# EAGLE design I2C Expantion sch (EAGLE 9.6.2)
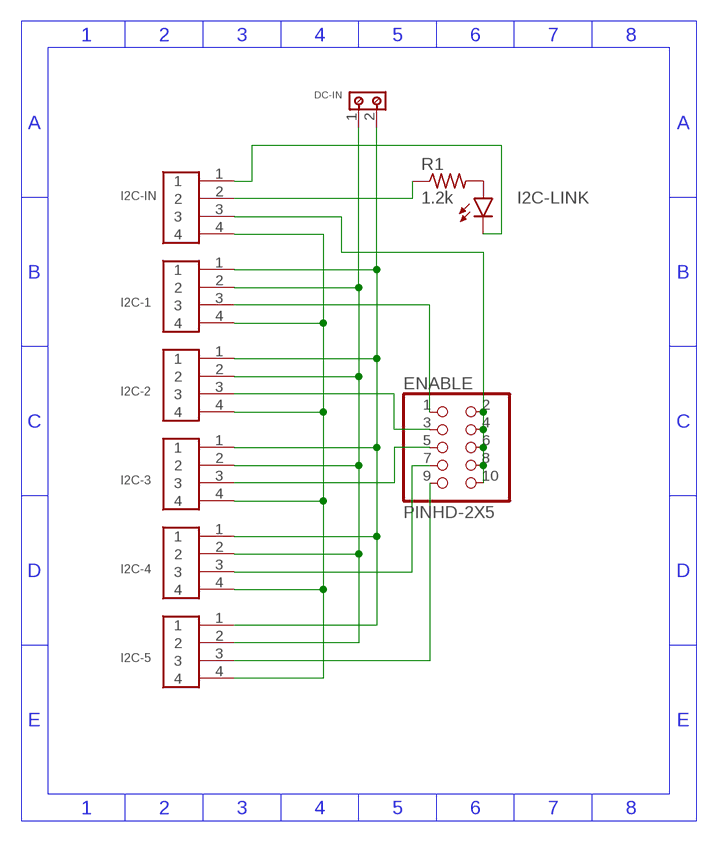
[diagram p0: schematic, sheet 1]

## Parts
DC-IN  691201620002  [691201620002]
ENABLE  PINHD-2X5  [2X05]
I2C-1  B4B-XH-A(LF)(SN)  [B4B-XH-A(LF)(SN)]
I2C-2  B4B-XH-A(LF)(SN)  [B4B-XH-A(LF)(SN)]
I2C-3  B4B-XH-A(LF)(SN)  [B4B-XH-A(LF)(SN)]
I2C-4  B4B-XH-A(LF)(SN)  [B4B-XH-A(LF)(SN)]
I2C-5  B4B-XH-A(LF)(SN)  [B4B-XH-A(LF)(SN)]
I2C-IN  B4B-XH-A(LF)(SN)  [B4B-XH-A(LF)(SN)]
I2C-LINK  LED_BLUE  LED_RADIAL_BLUE  [LEDRD254W60D565H860B_B]
R1  1.2k  R-US_AXIAL-7.2MM-PITCH  [RESAD724W46L381D178B]

## Nets
GND: DC-IN.2 I2C-1.1 I2C-2.1 I2C-3.1 I2C-4.1 I2C-5.1
N$1: I2C-LINK.1(A) R1.2
N$2: I2C-IN.2 R1.1
N$3: I2C-IN.1 I2C-LINK.2(C)
N$4: ENABLE.9 I2C-5.3
N$5: ENABLE.7 I2C-4.3
N$6: ENABLE.5 I2C-3.3
N$7: ENABLE.3 I2C-2.3
N$8: ENABLE.1 I2C-1.3
SCL: I2C-1.4 I2C-2.4 I2C-3.4 I2C-4.4 I2C-5.4 I2C-IN.4
SDA: ENABLE.2 ENABLE.4 ENABLE.6 ENABLE.8 ENABLE.10 I2C-IN.3
VCC: DC-IN.1 I2C-1.2 I2C-2.2 I2C-3.2 I2C-4.2 I2C-5.2

## Library data of the parts
DC-IN = Wurth_Connectors_WR-TBL Rising Cage Clamp:691201620002: WR-TBL Serie 2016 - 10.16 mm 45° Entry w. Rising Cage Clamp KIND PROPERTIES Pitch 10.16 mm MATERIAL PROPERTIES Insulator Material PA6/66 Insulator Flammability Rating UL94 V-0 Insulator Color Grey Contact Material Steel Contact Plating Zinc Terminal Screw Material Steel Terminal Screw Plating Zinc Wire Guard Material Copper Alloy with Tin GENERAL INFORMATION Operating Temperature -30 up to +120 °C Compliance Lead free / RoHS ELECTRICAL PROPERTIES IR UL 16 A IR VDE 24 A Working Voltage [UL] 300 V (AC) Working Voltage [VDE] 750 V (AC) Withstanding Voltage [UL] 1600 V (AC) Withstanding Voltage [VDE] 3000 V (AC) Contact Resistance 20 mΩ MECHANICAL PROPERTIES Wire Strip Length 6 (mm) Screw M3 CERTIFICATION UL Approval E150931 Cat No. COB (2) VDE Approval 40022115 Type COB PACKAGING PROPERTIES Packaging Box <https://www.we-online.com/catalog/media/o84017v209%20Family_WR-TBL_6912016200xx.jpg> Details see: https://www.we-online.com/catalog/en/TBL_10_16_2016_45-DEGREE_ENTRY_W_RISING_CAGE_CLAMP_6912016200xx/ Updated by Ella Wu 2019-12-03 2019(C) Wurth Elektronik; IR-UL: 16A; IR-VDE: 24A; PART-NUMBER: 691201620002; PINS: 2; PITCH: 10.16mm; TYPE: 45°; WIRE: 12 to 30 (AWG) 3.31 to 0.05 (mm²); WORKING-VOLTAGE-UL: 300V (AC); WORKING-VOLTAGE-VDE: 750V (AC)
ENABLE = Connector:PINHD-2X5: PIN HEADER; CATEGORY: CONNECTOR; SUB-CATEGORY: PIN-HEADER
I2C-1-I2C-5 I2C-IN = Headers:B4B-XH-A(LF)(SN): CONN HEADER VERT 4POS 2.5MM Manufacturer's datasheet <http://www.jst-mfg.com/product/pdf/eng/eXH.pdf>; CREATED_BY: PCBLayout.com; DIGIKEY_PARTNO: 455-2249-ND; MANUFACTURER: JST Sales America Inc.; MPN: B4B-XH-A(LF)(SN)
I2C-LINK = Opto-Electronic:LED_RADIAL: LED - Generic; CATEGORY: Opto-Electronic; SUB-CATEGORY: LED
R1 = Tutorial - Fusion 360:R-US: Resistor Fixed - ANSI; CATEGORY: Resistor; SUB-CATEGORY: Fixed

## Board
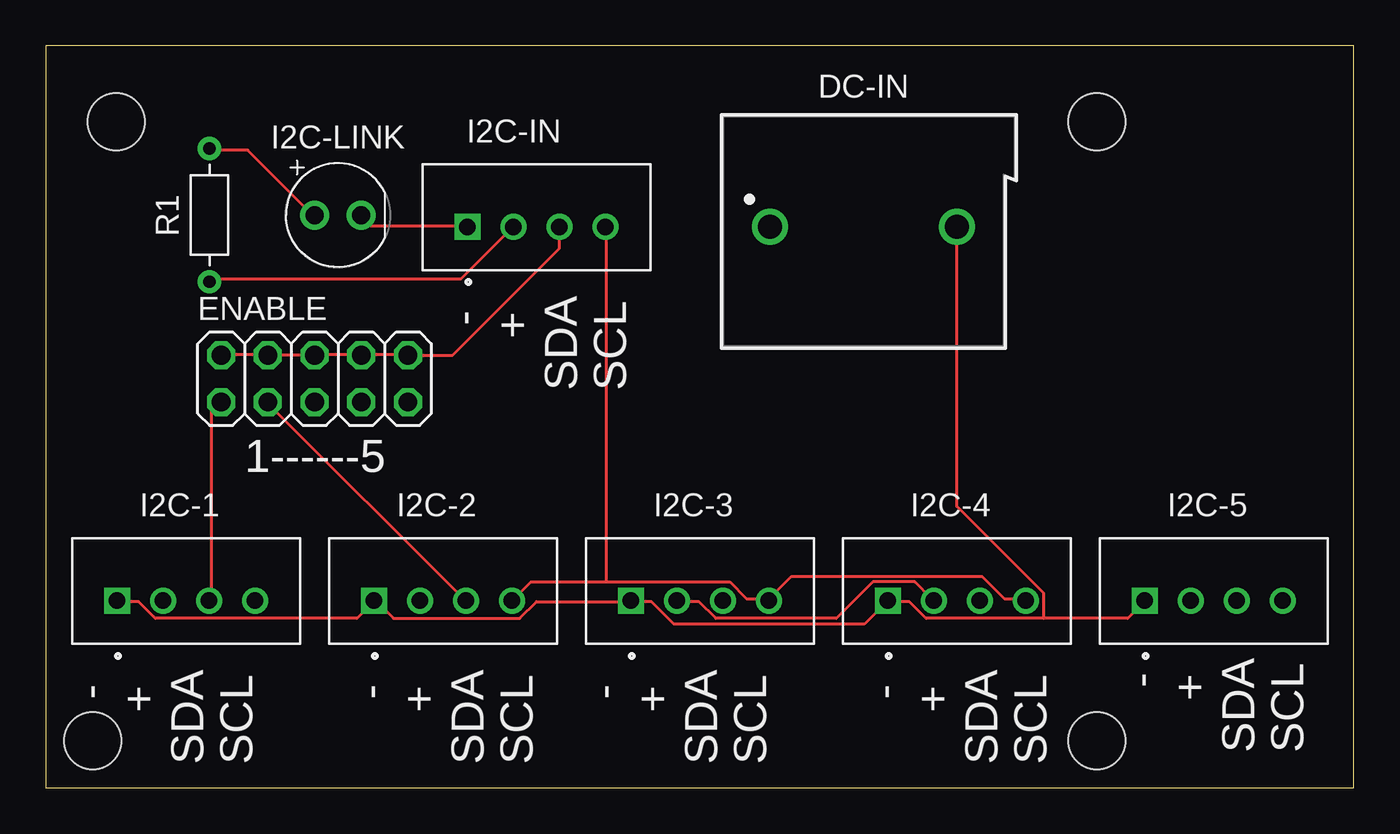
[diagram p1: board, top side]
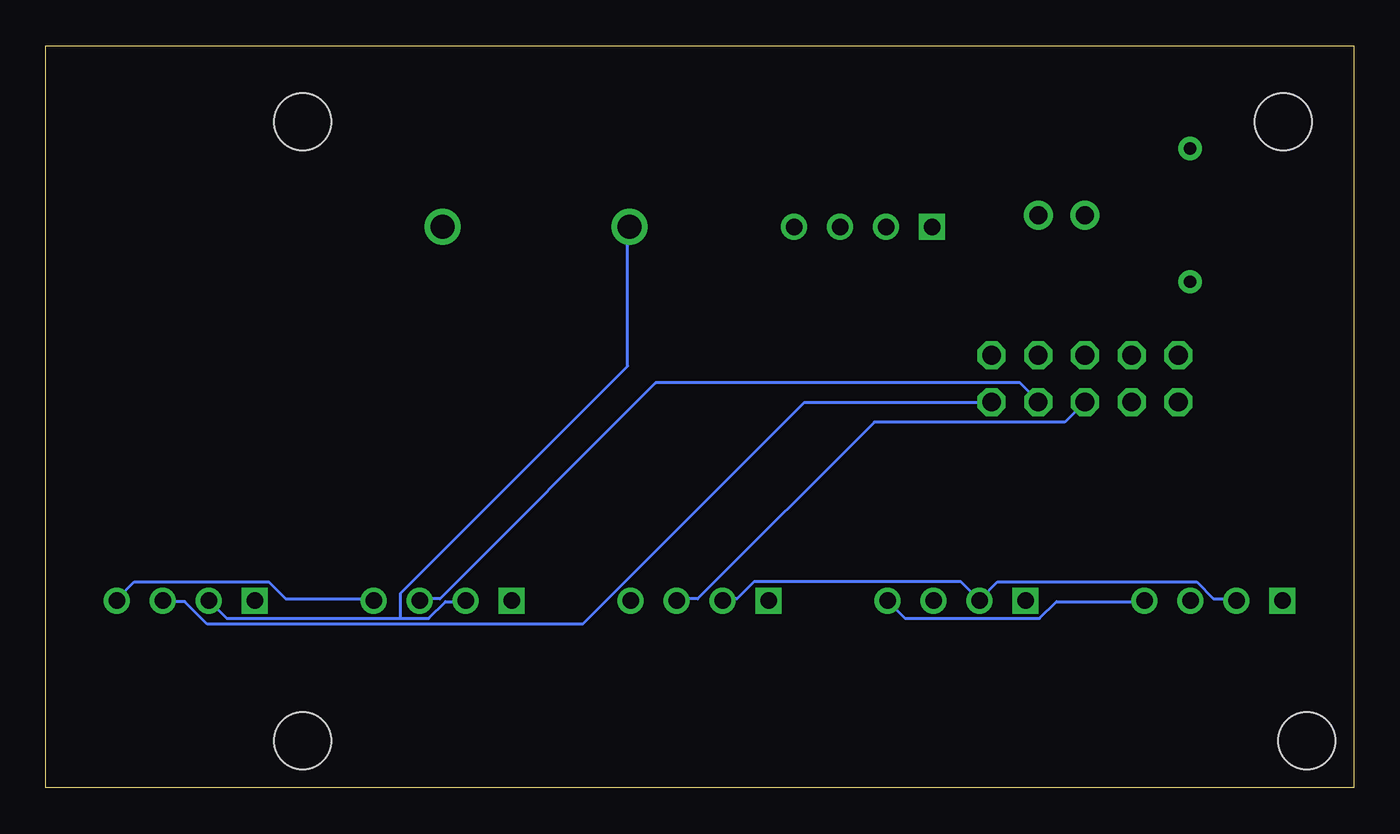
[diagram p2: board, bottom side, seen from below]

Size 71.1 x 40.31 mm. Coordinates in mm from the lower left corner, seen from the top.
Outline: 0,0 71.1,0 71.1,40.31 0,40.31 0,0
Copper layers (1*16): Top 0.035mm / dielectric 0.15mm / Bottom 0.035mm
Design rules "default": minimum track width 6mil, minimum drill 0.35mm, track to track 6mil, track to pad 6mil, pad to pad 6mil, via to via 6mil, smd to smd 6mil, copper to edge 40mil, drill to drill 6mil, minimum pad ring 10mil, minimum via ring 8mil, stop-mask expansion 4mil, vias tented up to drill 0mil, thermal gap 10mil
Holes 3.1 mm at 3.81,36.2 2.54,2.54 57.15,2.54 57.15,36.2

### Footprints (pad centres in the part's own frame; a part is rotated, then mirrored left to right if it is on the bottom)
691201620002 = drill 1.3: 1 -5.08,0; 2 5.08,0
2X05 = drill 1.016 octagon: 1 -5.08,-1.27; 2 -5.08,1.27; 3 -2.54,-1.27; 4 -2.54,1.27; 5 0,-1.27; 6 0,1.27; 7 2.54,-1.27; 8 2.54,1.27; 9 5.08,-1.27; 10 5.08,1.27
B4B-XH-A(LF)(SN) = drill 0.9 square: 1 -3.75,0 | drill 0.9: 2 -1.25,0; 3 1.25,0; 4 3.75,0
LEDRD254W60D565H860B_B = drill 0.981 pad 1.581: 1 -1.27,0; 2 1.27,0
RESAD724W46L381D178B = drill 0.66 pad 1.26: 1 -3.62,0; 2 3.62,0

### Placement (x,y rotation side)
DC-IN  44.45,30.48 0 top
ENABLE  14.61,22.23 0 top
I2C-1  7.62,10.16 0 top
I2C-2  21.59,10.16 0 top
I2C-3  35.56,10.16 0 top
I2C-4  49.53,10.16 0 top
I2C-5  63.5,10.16 0 top
I2C-IN  26.67,30.48 0 top
I2C-LINK  15.88,31.12 0 top
R1  8.89,31.12 90 top

### Tracks (layer width: path | path; a pad name or v marks a point on that pad's centre or on a via)
GND
  Top 0.152: I2C-1.1 3.96,10.11 5.03,10.11 5.94,9.2 16.92,9.2 17.83,10.11 I2C-2.1 17.98,10.11 18.9,9.2 25.76,9.2 26.67,10.11 31.7,10.11 I2C-3.1 31.85,10.11 32.92,10.11 34.14,8.89 44.5,8.89 45.72,10.11 I2C-4.1 45.87,10.11 46.94,10.11 47.85,9.2 54.25,9.2 | 54.25,9.2 58.83,9.2 59.74,10.11 I2C-5.1 | DC-IN.2 49.53,15.29 54.25,10.57 54.25,9.2
N$1
  Top 0.152: R1.2 8.99,34.65 10.97,34.65 14.48,31.14 I2C-LINK.1
N$2
  Top 0.152: R1.1 8.99,27.64 22.55,27.64 25.3,30.38 I2C-IN.2
N$3
  Top 0.152: I2C-IN.1 22.86,30.53 17.68,30.53 17.22,30.99 I2C-LINK.2
N$4
  Bottom 0.152: I2C-5.3 64.62,10.11 63.55,10.11 62.33,8.89 41.91,8.89 29.87,20.93 19.81,20.93 ENABLE.9
N$5
  Bottom 0.152: I2C-4.3 50.75,10.26 49.68,10.26 37.95,22 18.14,22 17.22,21.08 ENABLE.7
N$6
  Bottom 0.152: ENABLE.5 15.7,19.86 26.06,19.86 35.66,10.26 36.73,10.26 I2C-3.3
N$7
  Top 0.152: I2C-2.3 22.71,10.26 12.04,20.93 ENABLE.3
N$8
  Top 0.152: I2C-1.3 8.99,10.26 8.99,20.47 9.45,20.93 ENABLE.1
SCL
  Top 0.152: 30.48,11.18 26.36,11.18 25.45,10.26 I2C-2.4 | 30.48,11.18 37.19,11.18 38.1,10.26 39.17,10.26 I2C-3.4 39.32,10.26 40.54,11.48 50.9,11.48 52.12,10.26 53.19,10.26 I2C-4.4 | 30.48,11.18 30.48,30.38 I2C-IN.4
  Bottom 0.152: I2C-4.4 53.34,10.26 58.06,10.26 58.98,11.18 66.29,11.18 67.21,10.26 I2C-5.4 | I2C-1.4 11.43,10.11 16.15,10.11 17.07,9.2 24.38,9.2 25.3,10.11 I2C-2.4
SDA
  Top 0.152: ENABLE.2 9.6,23.52 12.04,23.52 ENABLE.4 12.19,23.52 14.48,23.52 ENABLE.6 14.63,23.52 17.07,23.52 ENABLE.8 17.22,23.52 19.66,23.52 ENABLE.10 22.1,23.5 27.92,29.31 I2C-IN.3
VCC
  Top 0.152: I2C-3.2 34.44,10.11 35.51,10.11 36.42,9.2 42.98,9.2 44.96,11.18 47.24,11.18 48.16,10.26 I2C-4.2
  Bottom 0.152: I2C-1.2 6.4,10.26 7.62,10.26 8.53,11.18 19.36,11.18 20.27,10.26 I2C-2.2 20.42,10.26 21.34,11.18 32.61,11.18 33.53,10.26 34.29,10.26 I2C-3.2 | 51.82,9.2 61.27,9.2 62.18,10.11 I2C-5.2 | 51.82,9.2 50.29,9.2 49.38,10.11 48.31,10.11 I2C-4.2 | 51.82,9.2 51.82,10.57 39.47,22.91 39.47,30.38 DC-IN.1

### Text on the board
tNames: - / + / SDA / SCL | 1------5 | - / + / SDA / SCL | - / + / SDA / SCL | - / + / SDA / SCL | - / + / SDA / SCL | - / + / SDA / SCL